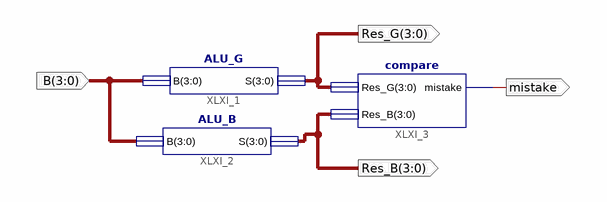
[diagram p0: schematic sheet 1]
// Xilinx ISE schematic scheme.sch (spartan3a) as structural Verilog: 3 symbols, 4 ports
module scheme (
  input  [3:0] B,
  output [3:0] Res_G,
  output [3:0] Res_B,
  output mistake
);

  ALU_G XLXI_1 (.B(B), .S(Res_G));
  ALU_B XLXI_2 (.B(B), .S(Res_B));
  compare XLXI_3 (.Res_G(Res_G), .Res_B(Res_B), .mistake(mistake));
endmodule
